# EAGLE design RFM69HW_SMA (EAGLE 7.2.0)
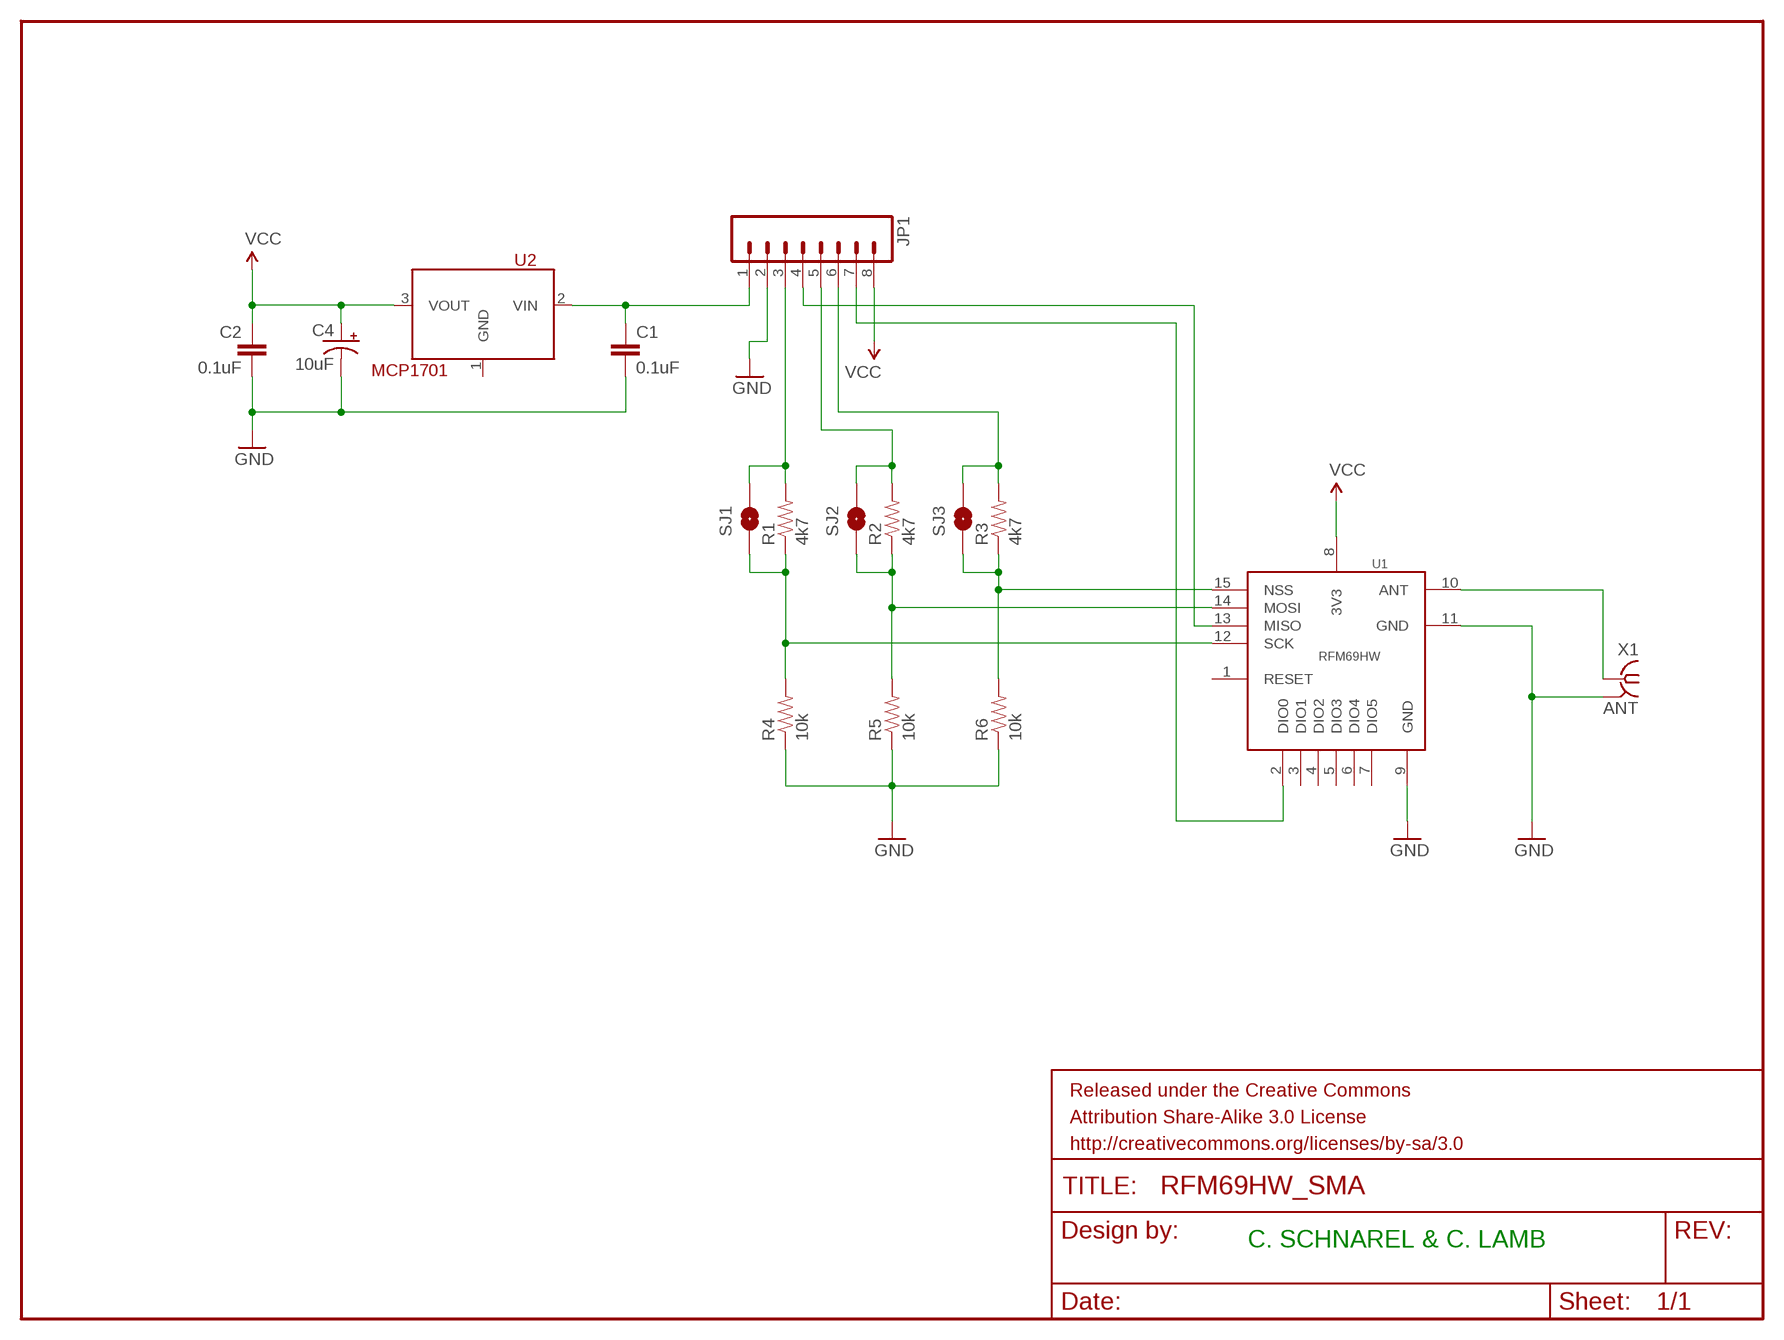
[diagram p0: schematic, sheet 1]

## Parts
C1  0.1uF  CAP0805  [0805]
C2  0.1uF  CAP0805  [0805]
C4  10uF  CAP_POL0805  [0805-POL]
FRAME1  FRAME-LETTER  [CREATIVE_COMMONS]
JP1  M08LONGPADS  [1X08_LONGPADS]
R1  4k7  RESISTOR0805-RES  [0805]
R2  4k7  RESISTOR0805-RES  [0805]
R3  4k7  RESISTOR0805-RES  [0805]
R4  10k  RESISTOR0805-RES  [0805]
R5  10k  RESISTOR0805-RES  [0805]
R6  10k  RESISTOR0805-RES  [0805]
SJ1  SOLDERJUMPERNO  [SJ_2S-NO]
SJ2  SOLDERJUMPERNO  [SJ_2S-NO]
SJ3  SOLDERJUMPERNO  [SJ_2S-NO]
U1  RFM69HW  [RFM69]
U2  MCP1701  [SOT-89]
X1  ANT  TE-SMA-JACK-STR  [TE-SMA-JACK-STR]

## Nets
GND: C1.2 C2.2 C4.2(-) JP1.2 R4.1 R5.1 R6.1 U1.9(GND) U1.11(GND) X1.2 X1.3 X1.4 X1.5
N$1: R3.1 R6.2 SJ3.1 U1.15(NSS)
N$2: C1.1 JP1.1 U2.2(VIN)
N$3: JP1.4 U1.13(MISO)
N$4: JP1.7 U1.2(DIO0)
N$5: R2.1 R5.2 SJ2.1 U1.14(MOSI)
N$6: JP1.3 R1.2 SJ1.2
N$7: JP1.5 R2.2 SJ2.2
N$9: JP1.6 R3.2 SJ3.2
N$10: R1.1 R4.2 SJ1.1 U1.12(SCK)
N$11: U1.10(ANT) X1.1
VCC: C2.1 C4.1(+) JP1.8 U1.8(3V3) U2.3(VOUT)
Unconnected: U1.1(RESET) U1.3(DIO1) U1.4(DIO2) U1.5(DIO3) U1.6(DIO4) U1.7(DIO5) U2.1(GND)

## Notes on the sheet
- C. SCHNAREL & C. LAMB

## Library data of the parts
C1 C2 = SparkFun-Capacitors:CAP: Capacitor Standard 0603 ceramic capacitor, and 0.1" leaded capacitor.
C4 = ChipsParts:CAP_POL
FRAME1 = SparkFun-Aesthetics:FRAME-LETTER: Schematic Frame Standard 8.5x11 US Letter frame
JP1 = SparkFun-Connectors:M08: Header 8 Standard 8-pin 0.1" header. Use with straight break away headers (SKU : PRT-00116), right angle break away headers (PRT-00553), swiss pins (PRT-00743), machine pins (PRT-00117), and female headers (PRT-00115).
R1-R6 = SparkFun-Resistors:RESISTOR: Resistor Basic schematic elements and footprints for 0603, 1206, and PTH resistors.
SJ1-SJ3 = SparkFun-Passives:SOLDERJUMPER: Solder Jumper Standard SMD solder jumper. Used to automate production. Two varients : Normally Open and Normally Closed are the same, but have different paste layers. NC will have a large amount of paste and should jumper during reflow.
U1 = custom_parts:RFM69: Radio Transceiver Module, FSK, 433, 848, 915 MHz, SPI controlled, Mfr=HopeRF
U2 = ChipsParts:MCP1701: Voltage Regulator, LDO, fixed 1.8,2.5,3.0,3.3,5.0V, 500mW/Vdrop
X1 = custom_parts:TE-SMA-JACK-STR: FEMALE SMA STRAIGHT CONNECTOR TE Connectivity DigiKey A97594-ND <http://www.digikey.com/product-detail/en/5-1814832-1/A97594-ND/1755982>; MF: TE Connectivity; MPN: 5-1814832-1; OC_DIGIKEY: A97594-ND

## Net classes
0 default: clearance 0.305 mm

## Board
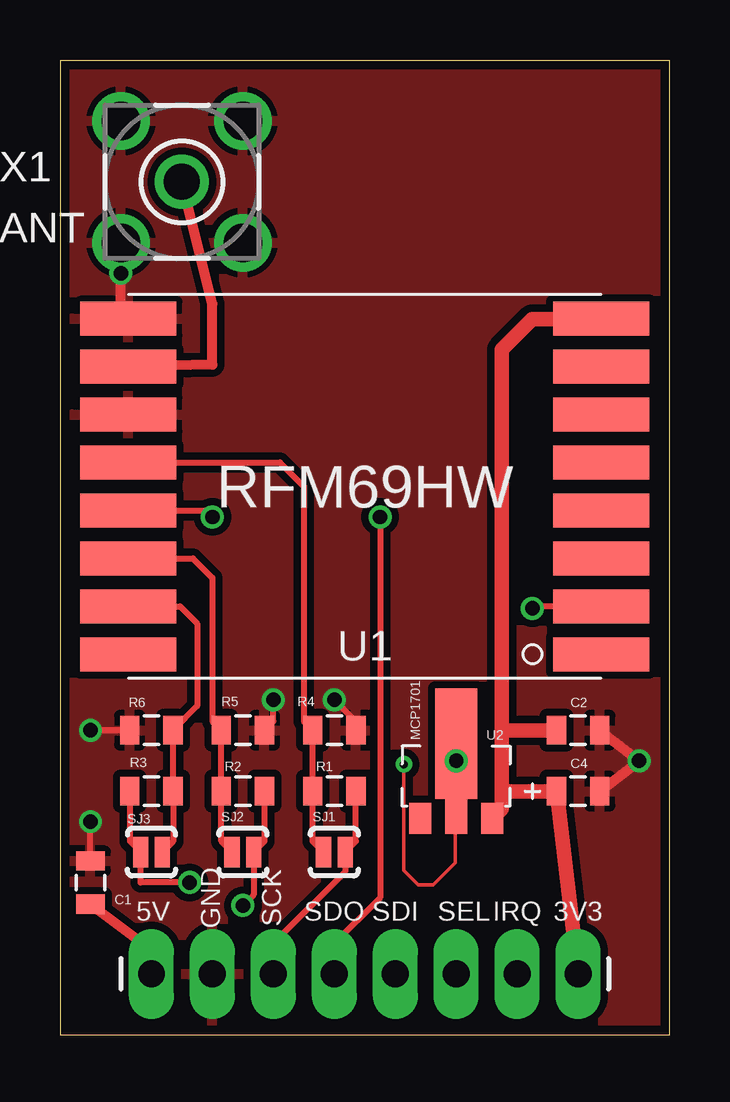
[diagram p1: board, top side]
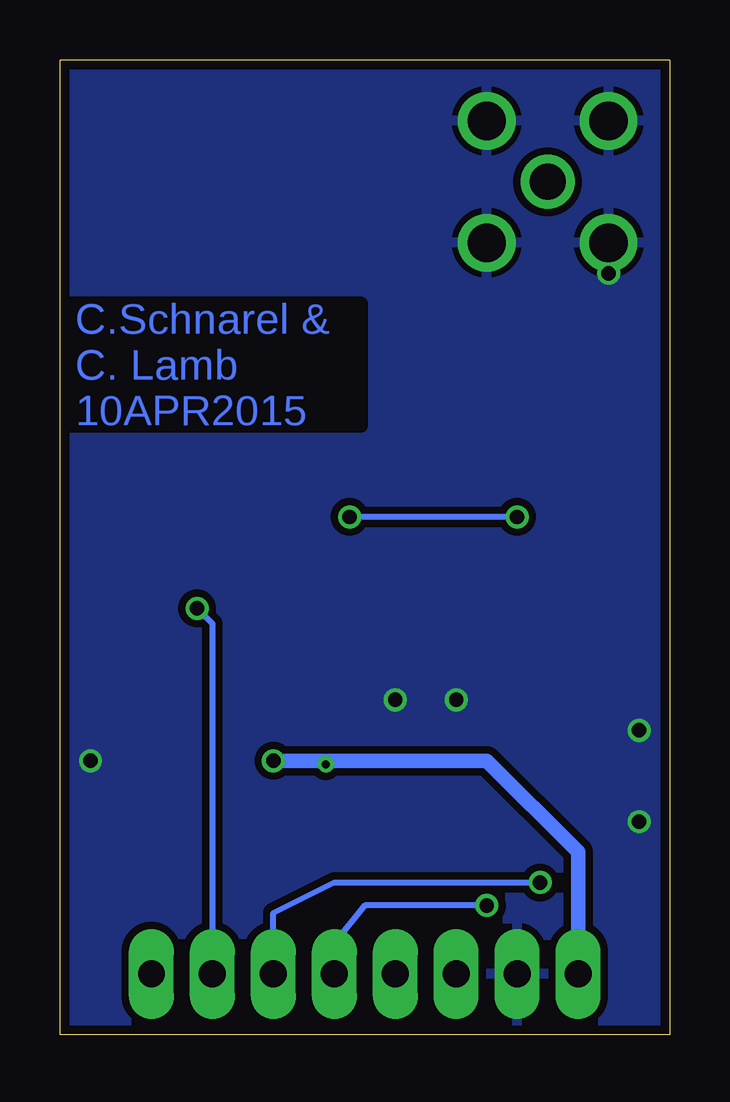
[diagram p2: board, bottom side, seen from below]

Size 25.4 x 40.64 mm. Coordinates in mm from the lower left corner, seen from the top.
Outline: 0,0 25.4,0 25.4,40.64 0,40.64 0,0
Copper layers (1*16): Top 0.0356mm / dielectric 1.5011mm / Bottom 0.0356mm
Design rules "LaenPCBOrder": minimum track width 6mil, minimum drill 13mil, track to track 6mil, track to pad 6mil, pad to pad 6mil, via to via 6mil, smd to smd 6mil, copper to edge 15mil, drill to drill 6mil, minimum pad ring 7mil, minimum via ring 7mil, stop-mask expansion 3mil, vias tented up to drill 0mil, thermal gap 10mil

### Footprints (pad centres in the part's own frame; a part is rotated, then mirrored left to right if it is on the bottom)
0805 = smd 0.8 x 1.2: 1 -0.9,0; 2 0.9,0
0805-POL = smd 0.8 x 1.2: 1 -0.9,0; 2 0.9,0
1X08_LONGPADS = drill 1.118 pad 1.88 long: 1 0,0; 2 2.54,0; 3 5.08,0; 4 7.62,0; 5 10.16,0; 6 12.7,0; 7 15.24,0; 8 17.78,0
SJ_2S-NO = smd 0.635 x 1.27: 1 -0.45,0; 2 0.45,0
RFM69 = smd 4 x 1.4: 1 -9.85,7; 2 -9.85,5; 3 -9.85,3; 4 -9.85,1; 5 -9.85,-1; 6 -9.85,-3; 7 -9.85,-5; 8 -9.85,-7; 9 9.85,-7; 10 9.85,-5; 11 9.85,-3; 12 9.85,-1; 13 9.85,1; 14 9.85,3; 15 9.85,5; 16 9.85,7
SOT-89 = smd 0.9 x 1.3: 1 -1.5,-1.775; 3 1.5,-1.775 | smd 0.9 x 1.475: 2 0,-1.688 | smd 1.733 x 4.6: P$4 0,1.35
TE-SMA-JACK-STR = drill 1.5: 1 0,0 | drill 1.6: 2 -2.54,2.54; 3 2.54,2.54; 4 2.54,-2.54; 5 -2.54,-2.54

### Placement (x,y rotation side)
C1  1.27,6.35 90 top
C2  21.59,12.7 0 top
C4  21.59,10.16 0 top
FRAME1  17.78,-8.89 0 top  (outside the outline)
JP1  3.81,2.54 0 top
R1  11.43,10.16 0 top
R2  7.62,10.16 0 top
R3  3.81,10.16 180 top
R4  11.43,12.7 180 top
R5  7.62,12.7 180 top
R6  3.81,12.7 0 top
SJ1  11.43,7.62 0 top
SJ2  7.62,7.62 0 top
SJ3  3.81,7.62 180 top
U1  12.7,22.86 180 top
U2  16.51,10.79 0 top
X1  5.08,35.56 0 top

### Tracks (layer width: path | path; a pad name or v marks a point on that pad's centre or on a via)
GND  (via drill 0.6)
  Top 0.254: R5.1 8.89,13.07 v8.89,13.97 | U1.9 2.54,30.17 | C1.2 v1.27,8.89 | R6.1 v1.27,12.7 | R4.1 12.33,13.07 v11.43,13.97
  Top 0.406: 2.54,30.17 v2.54,31.75 | C4.2 v24.13,11.43 C2.2
  pour Bottom: 0,0 0,40.64 25.4,40.64 25.4,0
  pour Top: 0,0 0,40.64 25.4,40.64 25.4,0
N$1
  Top 0.254: SJ3.1 4.71,8.07 R3.1 R6.2 5.71,13.71 5.71,17.14 5,17.86 U1.15
N$2  (via drill 0.33, 0.6)
  Top 0.152: v14.33,11.28 14.33,6.86 14.94,6.25 15.54,6.25 16.46,7.16 16.46,8.99 U2.2
  Top 0.406: JP1.1 3.81,3.54 C1.1
  Bottom 0.152: v14.33,11.28 14.33,11.43
  Bottom 0.61: v16.51,11.43 14.33,11.43 7.62,11.43 3.81,7.62 JP1.1
N$3  (via drill 0.6)
  Top 0.254: U1.13 6.08,21.86 v6.35,21.59 | v13.34,21.59 13.34,5.71 11.43,3.81 JP1.4
  Bottom 0.254: v6.35,21.59 v13.34,21.59
N$4  (via drill 0.6)
  Top 0.254: U1.2 19.77,17.86 v19.68,17.78
  Bottom 0.254: v19.68,17.78 19.05,17.14 JP1.7
N$5
  Top 0.254: SJ2.1 6.72,8.07 R2.1 R5.2 6.35,13.07 6.35,19.05 5.54,19.86 U1.14
N$6
  Top 0.254: R1.2 12.33,8.07 SJ1.2 11.88,6.8 8.89,3.81 JP1.3
N$7  (via drill 0.6)
  Top 0.254: R2.2 8.52,8.07 SJ2.2 8.07,5.85 v7.62,5.4
  Bottom 0.254: v7.62,5.4 12.7,5.4 13.97,3.81 JP1.5
N$9  (via drill 0.6)
  Top 0.254: v5.4,6.35 3.36,6.35 SJ3.2 2.91,8.07 R3.2
  Bottom 0.254: JP1.6 16.51,5.08 13.97,6.35 v5.4,6.35
N$10
  Top 0.254: SJ1.1 10.53,8.07 R1.1 R4.2 10.16,13.07 10.16,22.86 9.16,23.86 U1.12
N$11
  Top 0.152: 3.97,27.94 U1.10
  Top 0.406: U1.10 6.35,27.94 6.35,30.48 X1.1
VCC
  Top 0.254: 22.54,29.84 U1.8 | U2.3 18.01,9.12
  Top 0.61: 22.54,29.84 19.68,29.84 18.41,28.57 18.41,12.7 | 18.41,10.16 18.41,9.43 U2.3 | 18.41,10.16 18.41,12.7 | C2.1 18.41,12.7 | JP1.8 C4.1 18.41,10.16

### Text on the board
Bottom: C.Schnarel & / C. Lamb / 10APR2015
tPlace: GND | SCK | 5V | SDO | SDI | SEL | IRQ | 3V3